# EAGLE schematic SparkFun_Snappable_P-Board (EAGLE 7.1.0)
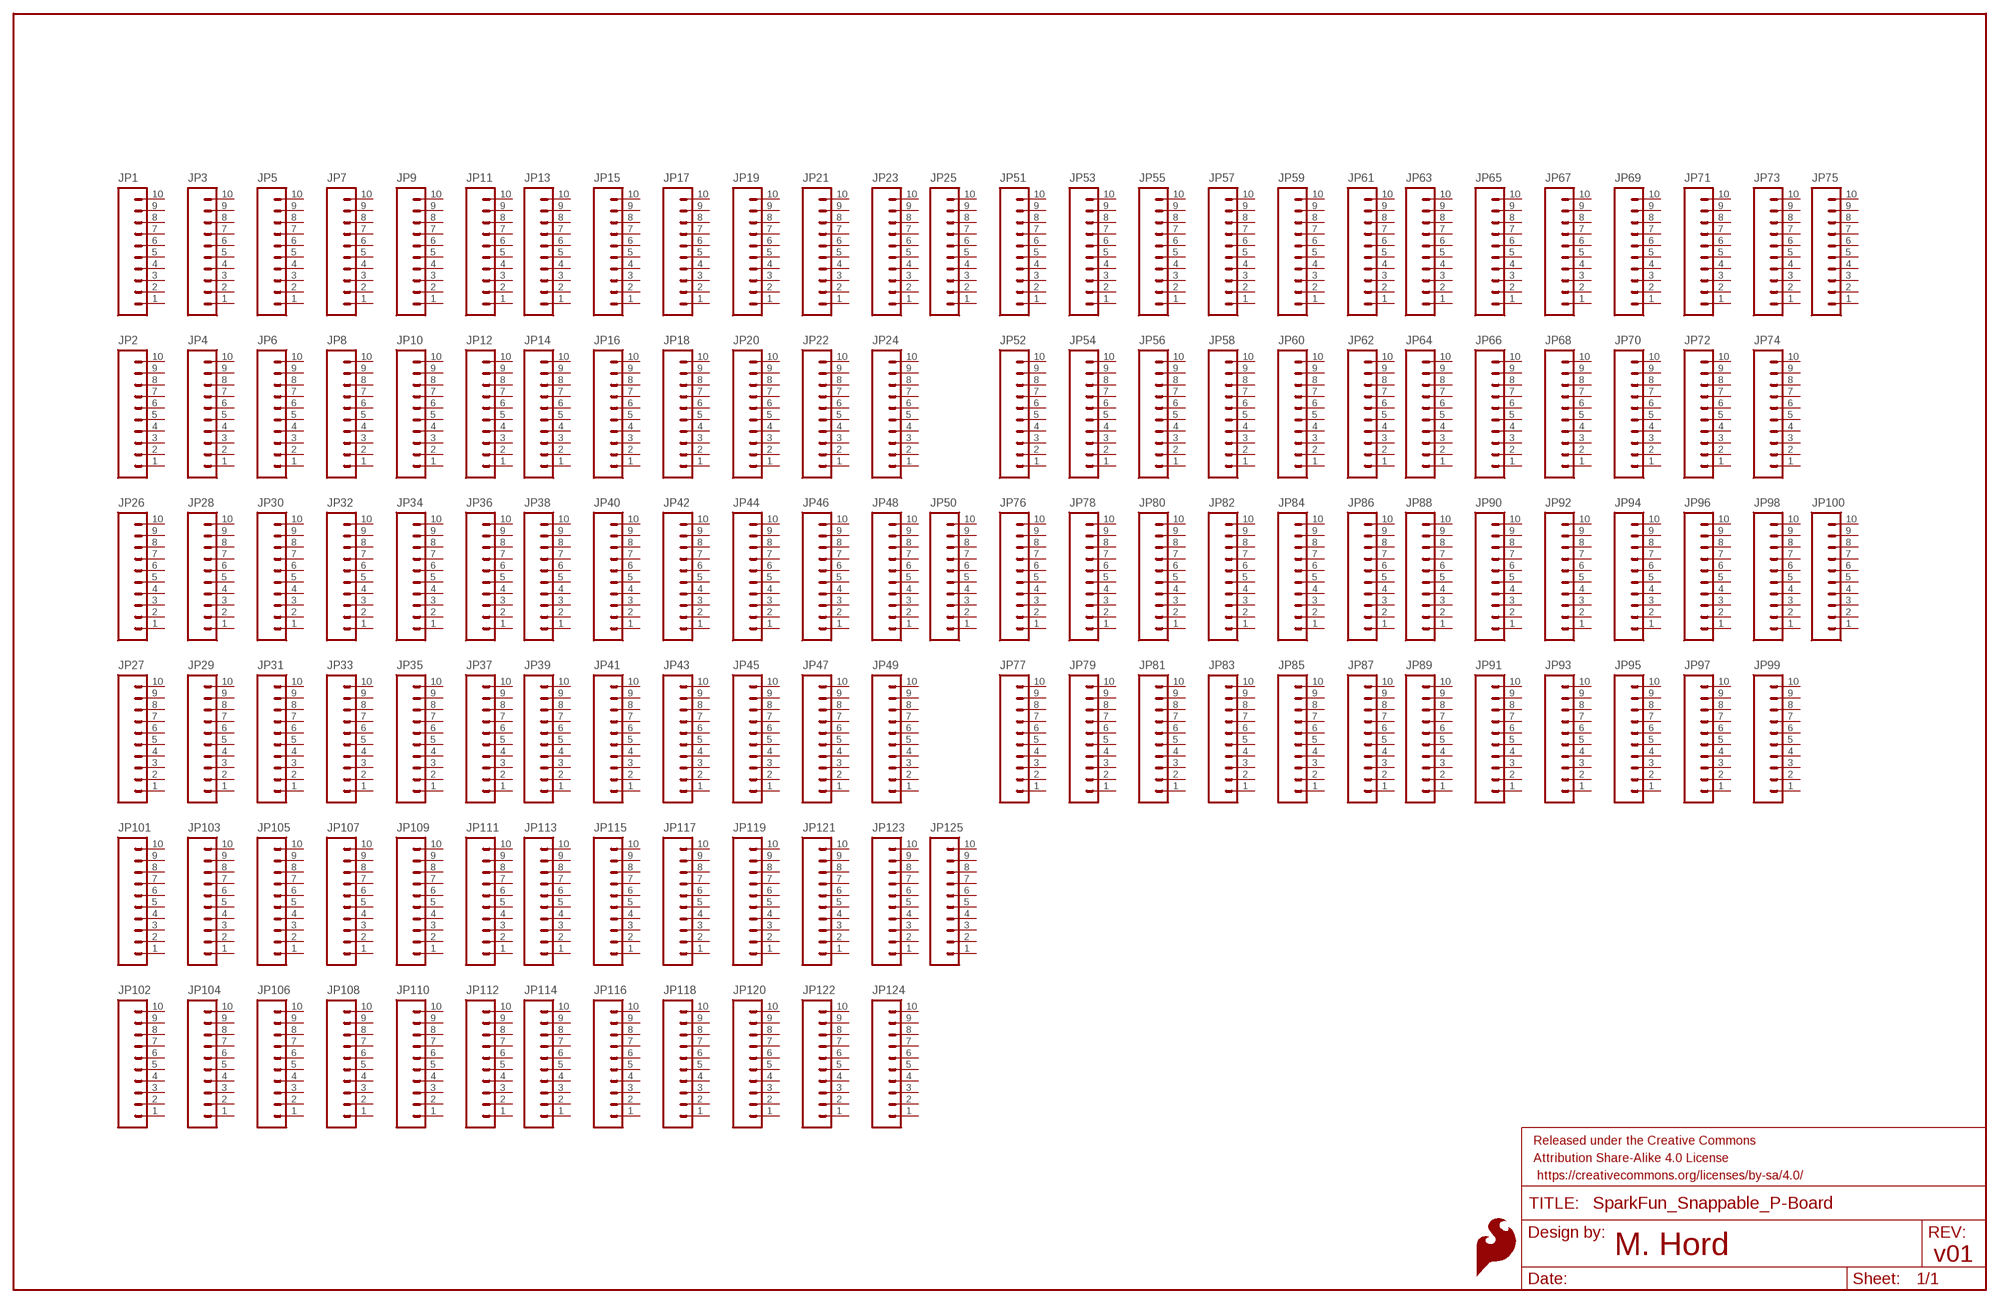
[diagram p0: schematic, sheet 1]

## Parts
FRAME1  FRAME-LEDGER  [CREATIVE_COMMONS]
JP1  M10NO_SILK_PTH_FEMALE  [1X10_NO_SILK]
JP2  M10NO_SILK_PTH_FEMALE  [1X10_NO_SILK]
JP3  M10NO_SILK_PTH_FEMALE  [1X10_NO_SILK]
JP4  M10NO_SILK_PTH_FEMALE  [1X10_NO_SILK]
JP5  M10NO_SILK_PTH_FEMALE  [1X10_NO_SILK]
JP6  M10NO_SILK_PTH_FEMALE  [1X10_NO_SILK]
JP7  M10NO_SILK_PTH_FEMALE  [1X10_NO_SILK]
JP8  M10NO_SILK_PTH_FEMALE  [1X10_NO_SILK]
JP9  M10NO_SILK_PTH_FEMALE  [1X10_NO_SILK]
JP10  M10NO_SILK_PTH_FEMALE  [1X10_NO_SILK]
JP11  M10NO_SILK_PTH_FEMALE  [1X10_NO_SILK]
JP12  M10NO_SILK_PTH_FEMALE  [1X10_NO_SILK]
JP13  M10NO_SILK_PTH_FEMALE  [1X10_NO_SILK]
JP14  M10NO_SILK_PTH_FEMALE  [1X10_NO_SILK]
JP15  M10NO_SILK_PTH_FEMALE  [1X10_NO_SILK]
JP16  M10NO_SILK_PTH_FEMALE  [1X10_NO_SILK]
JP17  M10NO_SILK_PTH_FEMALE  [1X10_NO_SILK]
JP18  M10NO_SILK_PTH_FEMALE  [1X10_NO_SILK]
JP19  M10NO_SILK_PTH_FEMALE  [1X10_NO_SILK]
JP20  M10NO_SILK_PTH_FEMALE  [1X10_NO_SILK]
JP21  M10NO_SILK_PTH_FEMALE  [1X10_NO_SILK]
JP22  M10NO_SILK_PTH_FEMALE  [1X10_NO_SILK]
JP23  M10NO_SILK_PTH_FEMALE  [1X10_NO_SILK]
JP24  M10NO_SILK_PTH_FEMALE  [1X10_NO_SILK]
JP25  M10NO_SILK_PTH_FEMALE  [1X10_NO_SILK]
JP26  M10NO_SILK_PTH_FEMALE  [1X10_NO_SILK]
JP27  M10NO_SILK_PTH_FEMALE  [1X10_NO_SILK]
JP28  M10NO_SILK_PTH_FEMALE  [1X10_NO_SILK]
JP29  M10NO_SILK_PTH_FEMALE  [1X10_NO_SILK]
JP30  M10NO_SILK_PTH_FEMALE  [1X10_NO_SILK]
JP31  M10NO_SILK_PTH_FEMALE  [1X10_NO_SILK]
JP32  M10NO_SILK_PTH_FEMALE  [1X10_NO_SILK]
JP33  M10NO_SILK_PTH_FEMALE  [1X10_NO_SILK]
JP34  M10NO_SILK_PTH_FEMALE  [1X10_NO_SILK]
JP35  M10NO_SILK_PTH_FEMALE  [1X10_NO_SILK]
JP36  M10NO_SILK_PTH_FEMALE  [1X10_NO_SILK]
JP37  M10NO_SILK_PTH_FEMALE  [1X10_NO_SILK]
JP38  M10NO_SILK_PTH_FEMALE  [1X10_NO_SILK]
JP39  M10NO_SILK_PTH_FEMALE  [1X10_NO_SILK]
JP40  M10NO_SILK_PTH_FEMALE  [1X10_NO_SILK]
JP41  M10NO_SILK_PTH_FEMALE  [1X10_NO_SILK]
JP42  M10NO_SILK_PTH_FEMALE  [1X10_NO_SILK]
JP43  M10NO_SILK_PTH_FEMALE  [1X10_NO_SILK]
JP44  M10NO_SILK_PTH_FEMALE  [1X10_NO_SILK]
JP45  M10NO_SILK_PTH_FEMALE  [1X10_NO_SILK]
JP46  M10NO_SILK_PTH_FEMALE  [1X10_NO_SILK]
JP47  M10NO_SILK_PTH_FEMALE  [1X10_NO_SILK]
JP48  M10NO_SILK_PTH_FEMALE  [1X10_NO_SILK]
JP49  M10NO_SILK_PTH_FEMALE  [1X10_NO_SILK]
JP50  M10NO_SILK_PTH_FEMALE  [1X10_NO_SILK]
JP51  M10NO_SILK_PTH_FEMALE  [1X10_NO_SILK]
JP52  M10NO_SILK_PTH_FEMALE  [1X10_NO_SILK]
JP53  M10NO_SILK_PTH_FEMALE  [1X10_NO_SILK]
JP54  M10NO_SILK_PTH_FEMALE  [1X10_NO_SILK]
JP55  M10NO_SILK_PTH_FEMALE  [1X10_NO_SILK]
JP56  M10NO_SILK_PTH_FEMALE  [1X10_NO_SILK]
JP57  M10NO_SILK_PTH_FEMALE  [1X10_NO_SILK]
JP58  M10NO_SILK_PTH_FEMALE  [1X10_NO_SILK]
JP59  M10NO_SILK_PTH_FEMALE  [1X10_NO_SILK]
JP60  M10NO_SILK_PTH_FEMALE  [1X10_NO_SILK]
JP61  M10NO_SILK_PTH_FEMALE  [1X10_NO_SILK]
JP62  M10NO_SILK_PTH_FEMALE  [1X10_NO_SILK]
JP63  M10NO_SILK_PTH_FEMALE  [1X10_NO_SILK]
JP64  M10NO_SILK_PTH_FEMALE  [1X10_NO_SILK]
JP65  M10NO_SILK_PTH_FEMALE  [1X10_NO_SILK]
JP66  M10NO_SILK_PTH_FEMALE  [1X10_NO_SILK]
JP67  M10NO_SILK_PTH_FEMALE  [1X10_NO_SILK]
JP68  M10NO_SILK_PTH_FEMALE  [1X10_NO_SILK]
JP69  M10NO_SILK_PTH_FEMALE  [1X10_NO_SILK]
JP70  M10NO_SILK_PTH_FEMALE  [1X10_NO_SILK]
JP71  M10NO_SILK_PTH_FEMALE  [1X10_NO_SILK]
JP72  M10NO_SILK_PTH_FEMALE  [1X10_NO_SILK]
JP73  M10NO_SILK_PTH_FEMALE  [1X10_NO_SILK]
JP74  M10NO_SILK_PTH_FEMALE  [1X10_NO_SILK]
JP75  M10NO_SILK_PTH_FEMALE  [1X10_NO_SILK]
JP76  M10NO_SILK_PTH_FEMALE  [1X10_NO_SILK]
JP77  M10NO_SILK_PTH_FEMALE  [1X10_NO_SILK]
JP78  M10NO_SILK_PTH_FEMALE  [1X10_NO_SILK]
JP79  M10NO_SILK_PTH_FEMALE  [1X10_NO_SILK]
JP80  M10NO_SILK_PTH_FEMALE  [1X10_NO_SILK]
JP81  M10NO_SILK_PTH_FEMALE  [1X10_NO_SILK]
JP82  M10NO_SILK_PTH_FEMALE  [1X10_NO_SILK]
JP83  M10NO_SILK_PTH_FEMALE  [1X10_NO_SILK]
JP84  M10NO_SILK_PTH_FEMALE  [1X10_NO_SILK]
JP85  M10NO_SILK_PTH_FEMALE  [1X10_NO_SILK]
JP86  M10NO_SILK_PTH_FEMALE  [1X10_NO_SILK]
JP87  M10NO_SILK_PTH_FEMALE  [1X10_NO_SILK]
JP88  M10NO_SILK_PTH_FEMALE  [1X10_NO_SILK]
JP89  M10NO_SILK_PTH_FEMALE  [1X10_NO_SILK]
JP90  M10NO_SILK_PTH_FEMALE  [1X10_NO_SILK]
JP91  M10NO_SILK_PTH_FEMALE  [1X10_NO_SILK]
JP92  M10NO_SILK_PTH_FEMALE  [1X10_NO_SILK]
JP93  M10NO_SILK_PTH_FEMALE  [1X10_NO_SILK]
JP94  M10NO_SILK_PTH_FEMALE  [1X10_NO_SILK]
JP95  M10NO_SILK_PTH_FEMALE  [1X10_NO_SILK]
JP96  M10NO_SILK_PTH_FEMALE  [1X10_NO_SILK]
JP97  M10NO_SILK_PTH_FEMALE  [1X10_NO_SILK]
JP98  M10NO_SILK_PTH_FEMALE  [1X10_NO_SILK]
JP99  M10NO_SILK_PTH_FEMALE  [1X10_NO_SILK]
JP100  M10NO_SILK_PTH_FEMALE  [1X10_NO_SILK]
JP101  M10NO_SILK_PTH_FEMALE  [1X10_NO_SILK]
JP102  M10NO_SILK_PTH_FEMALE  [1X10_NO_SILK]
JP103  M10NO_SILK_PTH_FEMALE  [1X10_NO_SILK]
JP104  M10NO_SILK_PTH_FEMALE  [1X10_NO_SILK]
JP105  M10NO_SILK_PTH_FEMALE  [1X10_NO_SILK]
JP106  M10NO_SILK_PTH_FEMALE  [1X10_NO_SILK]
JP107  M10NO_SILK_PTH_FEMALE  [1X10_NO_SILK]
JP108  M10NO_SILK_PTH_FEMALE  [1X10_NO_SILK]
JP109  M10NO_SILK_PTH_FEMALE  [1X10_NO_SILK]
JP110  M10NO_SILK_PTH_FEMALE  [1X10_NO_SILK]
JP111  M10NO_SILK_PTH_FEMALE  [1X10_NO_SILK]
JP112  M10NO_SILK_PTH_FEMALE  [1X10_NO_SILK]
JP113  M10NO_SILK_PTH_FEMALE  [1X10_NO_SILK]
JP114  M10NO_SILK_PTH_FEMALE  [1X10_NO_SILK]
JP115  M10NO_SILK_PTH_FEMALE  [1X10_NO_SILK]
JP116  M10NO_SILK_PTH_FEMALE  [1X10_NO_SILK]
JP117  M10NO_SILK_PTH_FEMALE  [1X10_NO_SILK]
JP118  M10NO_SILK_PTH_FEMALE  [1X10_NO_SILK]
JP119  M10NO_SILK_PTH_FEMALE  [1X10_NO_SILK]
JP120  M10NO_SILK_PTH_FEMALE  [1X10_NO_SILK]
JP121  M10NO_SILK_PTH_FEMALE  [1X10_NO_SILK]
JP122  M10NO_SILK_PTH_FEMALE  [1X10_NO_SILK]
JP123  M10NO_SILK_PTH_FEMALE  [1X10_NO_SILK]
JP124  M10NO_SILK_PTH_FEMALE  [1X10_NO_SILK]
JP125  M10NO_SILK_PTH_FEMALE  [1X10_NO_SILK]
LOGO1  SFE_LOGO_FLAME0.05_INCH  [SFE_LOGO_FLAME_.05]
LOGO2  SFE_LOGO_FLAME0.05_INCH  [SFE_LOGO_FLAME_.05]
Unconnected: JP1.1 JP1.2 JP1.3 JP1.4 JP1.5 JP1.6 JP1.7 JP1.8 JP1.9 JP1.10 JP2.1 JP2.2 JP2.3 JP2.4 JP2.5 JP2.6 JP2.7 JP2.8 JP2.9 JP2.10 JP3.1 JP3.2 JP3.3 JP3.4 JP3.5 JP3.6 JP3.7 JP3.8 JP3.9 JP3.10 JP4.1 JP4.2 JP4.3 JP4.4 JP4.5 JP4.6 JP4.7 JP4.8 JP4.9 JP4.10 JP5.1 JP5.2 JP5.3 JP5.4 JP5.5 JP5.6 JP5.7 JP5.8 JP5.9 JP5.10 JP6.1 JP6.2 JP6.3 JP6.4 JP6.5 JP6.6 JP6.7 JP6.8 JP6.9 JP6.10 JP7.1 JP7.2 JP7.3 JP7.4 JP7.5 JP7.6 JP7.7 JP7.8 JP7.9 JP7.10 JP8.1 JP8.2 JP8.3 JP8.4 JP8.5 JP8.6 JP8.7 JP8.8 JP8.9 JP8.10 JP9.1 JP9.2 JP9.3 JP9.4 JP9.5 JP9.6 JP9.7 JP9.8 JP9.9 JP9.10 JP10.1 JP10.2 JP10.3 JP10.4 JP10.5 JP10.6 JP10.7 JP10.8 JP10.9 JP10.10 JP11.1 JP11.2 JP11.3 JP11.4 JP11.5 JP11.6 JP11.7 JP11.8 JP11.9 JP11.10 JP12.1 JP12.2 JP12.3 JP12.4 JP12.5 JP12.6 JP12.7 JP12.8 JP12.9 JP12.10 JP13.1 JP13.2 JP13.3 JP13.4 JP13.5 JP13.6 JP13.7 JP13.8 JP13.9 JP13.10 JP14.1 JP14.2 JP14.3 JP14.4 JP14.5 JP14.6 JP14.7 JP14.8 JP14.9 JP14.10 JP15.1 JP15.2 JP15.3 JP15.4 JP15.5 JP15.6 JP15.7 JP15.8 JP15.9 JP15.10 JP16.1 JP16.2 JP16.3 JP16.4 JP16.5 JP16.6 JP16.7 JP16.8 JP16.9 JP16.10 JP17.1 JP17.2 JP17.3 JP17.4 JP17.5 JP17.6 JP17.7 JP17.8 JP17.9 JP17.10 JP18.1 JP18.2 JP18.3 JP18.4 JP18.5 JP18.6 JP18.7 JP18.8 JP18.9 JP18.10 JP19.1 JP19.2 JP19.3 JP19.4 JP19.5 JP19.6 JP19.7 JP19.8 JP19.9 JP19.10 JP20.1 JP20.2 JP20.3 JP20.4 JP20.5 JP20.6 JP20.7 JP20.8 JP20.9 JP20.10 JP21.1 JP21.2 JP21.3 JP21.4 JP21.5 JP21.6 JP21.7 JP21.8 JP21.9 JP21.10 JP22.1 JP22.2 JP22.3 JP22.4 JP22.5 JP22.6 JP22.7 JP22.8 JP22.9 JP22.10 JP23.1 JP23.2 JP23.3 JP23.4 JP23.5 JP23.6 JP23.7 JP23.8 JP23.9 JP23.10 JP24.1 JP24.2 JP24.3 JP24.4 JP24.5 JP24.6 JP24.7 JP24.8 JP24.9 JP24.10 JP25.1 JP25.2 JP25.3 JP25.4 JP25.5 JP25.6 JP25.7 JP25.8 JP25.9 JP25.10 JP26.1 JP26.2 JP26.3 JP26.4 JP26.5 JP26.6 JP26.7 JP26.8 JP26.9 JP26.10 JP27.1 JP27.2 JP27.3 JP27.4 JP27.5 JP27.6 JP27.7 JP27.8 JP27.9 JP27.10 JP28.1 JP28.2 JP28.3 JP28.4 JP28.5 JP28.6 JP28.7 JP28.8 JP28.9 JP28.10 JP29.1 JP29.2 JP29.3 JP29.4 JP29.5 JP29.6 JP29.7 JP29.8 JP29.9 JP29.10 JP30.1 JP30.2 JP30.3 JP30.4 JP30.5 JP30.6 JP30.7 JP30.8 JP30.9 JP30.10 JP31.1 JP31.2 JP31.3 JP31.4 JP31.5 JP31.6 JP31.7 JP31.8 JP31.9 JP31.10 JP32.1 JP32.2 JP32.3 JP32.4 JP32.5 JP32.6 JP32.7 JP32.8 JP32.9 JP32.10 JP33.1 JP33.2 JP33.3 JP33.4 JP33.5 JP33.6 JP33.7 JP33.8 JP33.9 JP33.10 JP34.1 JP34.2 JP34.3 JP34.4 JP34.5 JP34.6 JP34.7 JP34.8 JP34.9 JP34.10 JP35.1 JP35.2 JP35.3 JP35.4 JP35.5 JP35.6 JP35.7 JP35.8 JP35.9 JP35.10 JP36.1 JP36.2 JP36.3 JP36.4 JP36.5 JP36.6 JP36.7 JP36.8 JP36.9 JP36.10 JP37.1 JP37.2 JP37.3 JP37.4 JP37.5 JP37.6 JP37.7 JP37.8 JP37.9 JP37.10 JP38.1 JP38.2 JP38.3 JP38.4 JP38.5 JP38.6 JP38.7 JP38.8 JP38.9 JP38.10 JP39.1 JP39.2 JP39.3 JP39.4 JP39.5 JP39.6 JP39.7 JP39.8 JP39.9 JP39.10 JP40.1 JP40.2 JP40.3 JP40.4 JP40.5 JP40.6 JP40.7 JP40.8 JP40.9 JP40.10 JP41.1 JP41.2 JP41.3 JP41.4 JP41.5 JP41.6 JP41.7 JP41.8 JP41.9 JP41.10 JP42.1 JP42.2 JP42.3 JP42.4 JP42.5 JP42.6 JP42.7 JP42.8 JP42.9 JP42.10 JP43.1 JP43.2 JP43.3 JP43.4 JP43.5 JP43.6 JP43.7 JP43.8 JP43.9 JP43.10 JP44.1 JP44.2 JP44.3 JP44.4 JP44.5 JP44.6 JP44.7 JP44.8 JP44.9 JP44.10 JP45.1 JP45.2 JP45.3 JP45.4 JP45.5 JP45.6 JP45.7 JP45.8 JP45.9 JP45.10 JP46.1 JP46.2 JP46.3 JP46.4 JP46.5 JP46.6 JP46.7 JP46.8 JP46.9 JP46.10 JP47.1 JP47.2 JP47.3 JP47.4 JP47.5 JP47.6 JP47.7 JP47.8 JP47.9 JP47.10 JP48.1 JP48.2 JP48.3 JP48.4 JP48.5 JP48.6 JP48.7 JP48.8 JP48.9 JP48.10 JP49.1 JP49.2 JP49.3 JP49.4 JP49.5 JP49.6 JP49.7 JP49.8 JP49.9 JP49.10 JP50.1 JP50.2 JP50.3 JP50.4 JP50.5 JP50.6 JP50.7 JP50.8 JP50.9 JP50.10 JP51.1 JP51.2 JP51.3 JP51.4 JP51.5 JP51.6 JP51.7 JP51.8 JP51.9 JP51.10 JP52.1 JP52.2 JP52.3 JP52.4 JP52.5 JP52.6 JP52.7 JP52.8 JP52.9 JP52.10 JP53.1 JP53.2 JP53.3 JP53.4 JP53.5 JP53.6 JP53.7 JP53.8 JP53.9 JP53.10 JP54.1 JP54.2 JP54.3 JP54.4 JP54.5 JP54.6 JP54.7 JP54.8 JP54.9 JP54.10 JP55.1 JP55.2 JP55.3 JP55.4 JP55.5 JP55.6 JP55.7 JP55.8 JP55.9 JP55.10 JP56.1 JP56.2 JP56.3 JP56.4 JP56.5 JP56.6 JP56.7 JP56.8 JP56.9 JP56.10 JP57.1 JP57.2 JP57.3 JP57.4 JP57.5 JP57.6 JP57.7 JP57.8 JP57.9 JP57.10 JP58.1 JP58.2 JP58.3 JP58.4 JP58.5 JP58.6 JP58.7 JP58.8 JP58.9 JP58.10 JP59.1 JP59.2 JP59.3 JP59.4 JP59.5 JP59.6 JP59.7 JP59.8 JP59.9 JP59.10 JP60.1 JP60.2 JP60.3 JP60.4 JP60.5 JP60.6 JP60.7 JP60.8 JP60.9 JP60.10 JP61.1 JP61.2 JP61.3 JP61.4 JP61.5 JP61.6 JP61.7 JP61.8 JP61.9 JP61.10 JP62.1 JP62.2 JP62.3 JP62.4 JP62.5 JP62.6 JP62.7 JP62.8 JP62.9 JP62.10 JP63.1 JP63.2 JP63.3 JP63.4 JP63.5 JP63.6 JP63.7 JP63.8 JP63.9 JP63.10 JP64.1 JP64.2 JP64.3 JP64.4 JP64.5 JP64.6 JP64.7 JP64.8 JP64.9 JP64.10 JP65.1 JP65.2 JP65.3 JP65.4 JP65.5 JP65.6 JP65.7 JP65.8 JP65.9 JP65.10 JP66.1 JP66.2 JP66.3 JP66.4 JP66.5 JP66.6 JP66.7 JP66.8 JP66.9 JP66.10 JP67.1 JP67.2 JP67.3 JP67.4 JP67.5 JP67.6 JP67.7 JP67.8 JP67.9 JP67.10 JP68.1 JP68.2 JP68.3 JP68.4 JP68.5 JP68.6 JP68.7 JP68.8 JP68.9 JP68.10 JP69.1 JP69.2 JP69.3 JP69.4 JP69.5 JP69.6 JP69.7 JP69.8 JP69.9 JP69.10 JP70.1 JP70.2 JP70.3 JP70.4 JP70.5 JP70.6 JP70.7 JP70.8 JP70.9 JP70.10 JP71.1 JP71.2 JP71.3 JP71.4 JP71.5 JP71.6 JP71.7 JP71.8 JP71.9 JP71.10 JP72.1 JP72.2 JP72.3 JP72.4 JP72.5 JP72.6 JP72.7 JP72.8 JP72.9 JP72.10 JP73.1 JP73.2 JP73.3 JP73.4 JP73.5 JP73.6 JP73.7 JP73.8 JP73.9 JP73.10 JP74.1 JP74.2 JP74.3 JP74.4 JP74.5 JP74.6 JP74.7 JP74.8 JP74.9 JP74.10 JP75.1 JP75.2 JP75.3 JP75.4 JP75.5 JP75.6 JP75.7 JP75.8 JP75.9 JP75.10 JP76.1 JP76.2 JP76.3 JP76.4 JP76.5 JP76.6 JP76.7 JP76.8 JP76.9 JP76.10 JP77.1 JP77.2 JP77.3 JP77.4 JP77.5 JP77.6 JP77.7 JP77.8 JP77.9 JP77.10 JP78.1 JP78.2 JP78.3 JP78.4 JP78.5 JP78.6 JP78.7 JP78.8 JP78.9 JP78.10 JP79.1 JP79.2 JP79.3 JP79.4 JP79.5 JP79.6 JP79.7 JP79.8 JP79.9 JP79.10 JP80.1 JP80.2 JP80.3 JP80.4 JP80.5 JP80.6 JP80.7 JP80.8 JP80.9 JP80.10 JP81.1 JP81.2 JP81.3 JP81.4 JP81.5 JP81.6 JP81.7 JP81.8 JP81.9 JP81.10 JP82.1 JP82.2 JP82.3 JP82.4 JP82.5 JP82.6 JP82.7 JP82.8 JP82.9 JP82.10 JP83.1 JP83.2 JP83.3 JP83.4 JP83.5 JP83.6 JP83.7 JP83.8 JP83.9 JP83.10 JP84.1 JP84.2 JP84.3 JP84.4 JP84.5 JP84.6 JP84.7 JP84.8 JP84.9 JP84.10 JP85.1 JP85.2 JP85.3 JP85.4 JP85.5 JP85.6 JP85.7 JP85.8 JP85.9 JP85.10 JP86.1 JP86.2 JP86.3 JP86.4 JP86.5 JP86.6 JP86.7 JP86.8 JP86.9 JP86.10 JP87.1 JP87.2 JP87.3 JP87.4 JP87.5 JP87.6 JP87.7 JP87.8 JP87.9 JP87.10 JP88.1 JP88.2 JP88.3 JP88.4 JP88.5 JP88.6 JP88.7 JP88.8 JP88.9 JP88.10 JP89.1 JP89.2 JP89.3 JP89.4 JP89.5 JP89.6 JP89.7 JP89.8 JP89.9 JP89.10 JP90.1 JP90.2 JP90.3 JP90.4 JP90.5 JP90.6 JP90.7 JP90.8 JP90.9 JP90.10 JP91.1 JP91.2 JP91.3 JP91.4 JP91.5 JP91.6 JP91.7 JP91.8 JP91.9 JP91.10 JP92.1 JP92.2 JP92.3 JP92.4 JP92.5 JP92.6 JP92.7 JP92.8 JP92.9 JP92.10 JP93.1 JP93.2 JP93.3 JP93.4 JP93.5 JP93.6 JP93.7 JP93.8 JP93.9 JP93.10 JP94.1 JP94.2 JP94.3 JP94.4 JP94.5 JP94.6 JP94.7 JP94.8 JP94.9 JP94.10 JP95.1 JP95.2 JP95.3 JP95.4 JP95.5 JP95.6 JP95.7 JP95.8 JP95.9 JP95.10 JP96.1 JP96.2 JP96.3 JP96.4 JP96.5 JP96.6 JP96.7 JP96.8 JP96.9 JP96.10 JP97.1 JP97.2 JP97.3 JP97.4 JP97.5 JP97.6 JP97.7 JP97.8 JP97.9 JP97.10 JP98.1 JP98.2 JP98.3 JP98.4 JP98.5 JP98.6 JP98.7 JP98.8 JP98.9 JP98.10 JP99.1 JP99.2 JP99.3 JP99.4 JP99.5 JP99.6 JP99.7 JP99.8 JP99.9 JP99.10 JP100.1 JP100.2 JP100.3 JP100.4 JP100.5 JP100.6 JP100.7 JP100.8 JP100.9 JP100.10 JP101.1 JP101.2 JP101.3 JP101.4 JP101.5 JP101.6 JP101.7 JP101.8 JP101.9 JP101.10 JP102.1 JP102.2 JP102.3 JP102.4 JP102.5 JP102.6 JP102.7 JP102.8 JP102.9 JP102.10 JP103.1 JP103.2 JP103.3 JP103.4 JP103.5 JP103.6 JP103.7 JP103.8 JP103.9 JP103.10 JP104.1 JP104.2 JP104.3 JP104.4 JP104.5 JP104.6 JP104.7 JP104.8 JP104.9 JP104.10 JP105.1 JP105.2 JP105.3 JP105.4 JP105.5 JP105.6 JP105.7 JP105.8 JP105.9 JP105.10 JP106.1 JP106.2 JP106.3 JP106.4 JP106.5 JP106.6 JP106.7 JP106.8 JP106.9 JP106.10 JP107.1 JP107.2 JP107.3 JP107.4 JP107.5 JP107.6 JP107.7 JP107.8 JP107.9 JP107.10 JP108.1 JP108.2 JP108.3 JP108.4 JP108.5 JP108.6 JP108.7 JP108.8 JP108.9 JP108.10 JP109.1 JP109.2 JP109.3 JP109.4 JP109.5 JP109.6 JP109.7 JP109.8 JP109.9 JP109.10 JP110.1 JP110.2 JP110.3 JP110.4 JP110.5 JP110.6 JP110.7 JP110.8 JP110.9 JP110.10 JP111.1 JP111.2 JP111.3 JP111.4 JP111.5 JP111.6 JP111.7 JP111.8 JP111.9 JP111.10 JP112.1 JP112.2 JP112.3 JP112.4 JP112.5 JP112.6 JP112.7 JP112.8 JP112.9 JP112.10 JP113.1 JP113.2 JP113.3 JP113.4 JP113.5 JP113.6 JP113.7 JP113.8 JP113.9 JP113.10 JP114.1 JP114.2 JP114.3 JP114.4 JP114.5 JP114.6 JP114.7 JP114.8 JP114.9 JP114.10 JP115.1 JP115.2 JP115.3 JP115.4 JP115.5 JP115.6 JP115.7 JP115.8 JP115.9 JP115.10 JP116.1 JP116.2 JP116.3 JP116.4 JP116.5 JP116.6 JP116.7 JP116.8 JP116.9 JP116.10 JP117.1 JP117.2 JP117.3 JP117.4 JP117.5 JP117.6 JP117.7 JP117.8 JP117.9 JP117.10 JP118.1 JP118.2 JP118.3 JP118.4 JP118.5 JP118.6 JP118.7 JP118.8 JP118.9 JP118.10 JP119.1 JP119.2 JP119.3 JP119.4 JP119.5 JP119.6 JP119.7 JP119.8 JP119.9 JP119.10 JP120.1 JP120.2 JP120.3 JP120.4 JP120.5 JP120.6 JP120.7 JP120.8 JP120.9 JP120.10 JP121.1 JP121.2 JP121.3 JP121.4 JP121.5 JP121.6 JP121.7 JP121.8 JP121.9 JP121.10 JP122.1 JP122.2 JP122.3 JP122.4 JP122.5 JP122.6 JP122.7 JP122.8 JP122.9 JP122.10 JP123.1 JP123.2 JP123.3 JP123.4 JP123.5 JP123.6 JP123.7 JP123.8 JP123.9 JP123.10 JP124.1 JP124.2 JP124.3 JP124.4 JP124.5 JP124.6 JP124.7 JP124.8 JP124.9 JP124.10 JP125.1 JP125.2 JP125.3 JP125.4 JP125.5 JP125.6 JP125.7 JP125.8 JP125.9 JP125.10

## Notes on the sheet
- M. Hord
- v01

## Library data of the parts
FRAME1 = SparkFun-Aesthetics:FRAME-LEDGER: Schematic Frame Standard 11x14 US Ledger frame
JP1-JP125 = SparkFun-Connectors:M10: Header 10 Standard 10-pin 0.1" header. Use with straight break away headers (SKU : PRT-00116), right angle break away headers (PRT-00553), swiss pins (PRT-00743), machine pins (PRT-00117), and female headers (PRT-00115).; PROD_ID: CONN-11563
LOGO1 LOGO2 = SparkFun-Aesthetics:SFE_LOGO_FLAME: SFE Logo, flame only This is the SparkFun flame logo. The logo on the schematic will always be the same size; the package variant is the height of the flame. Default layer for the logo on the board is tSilk.